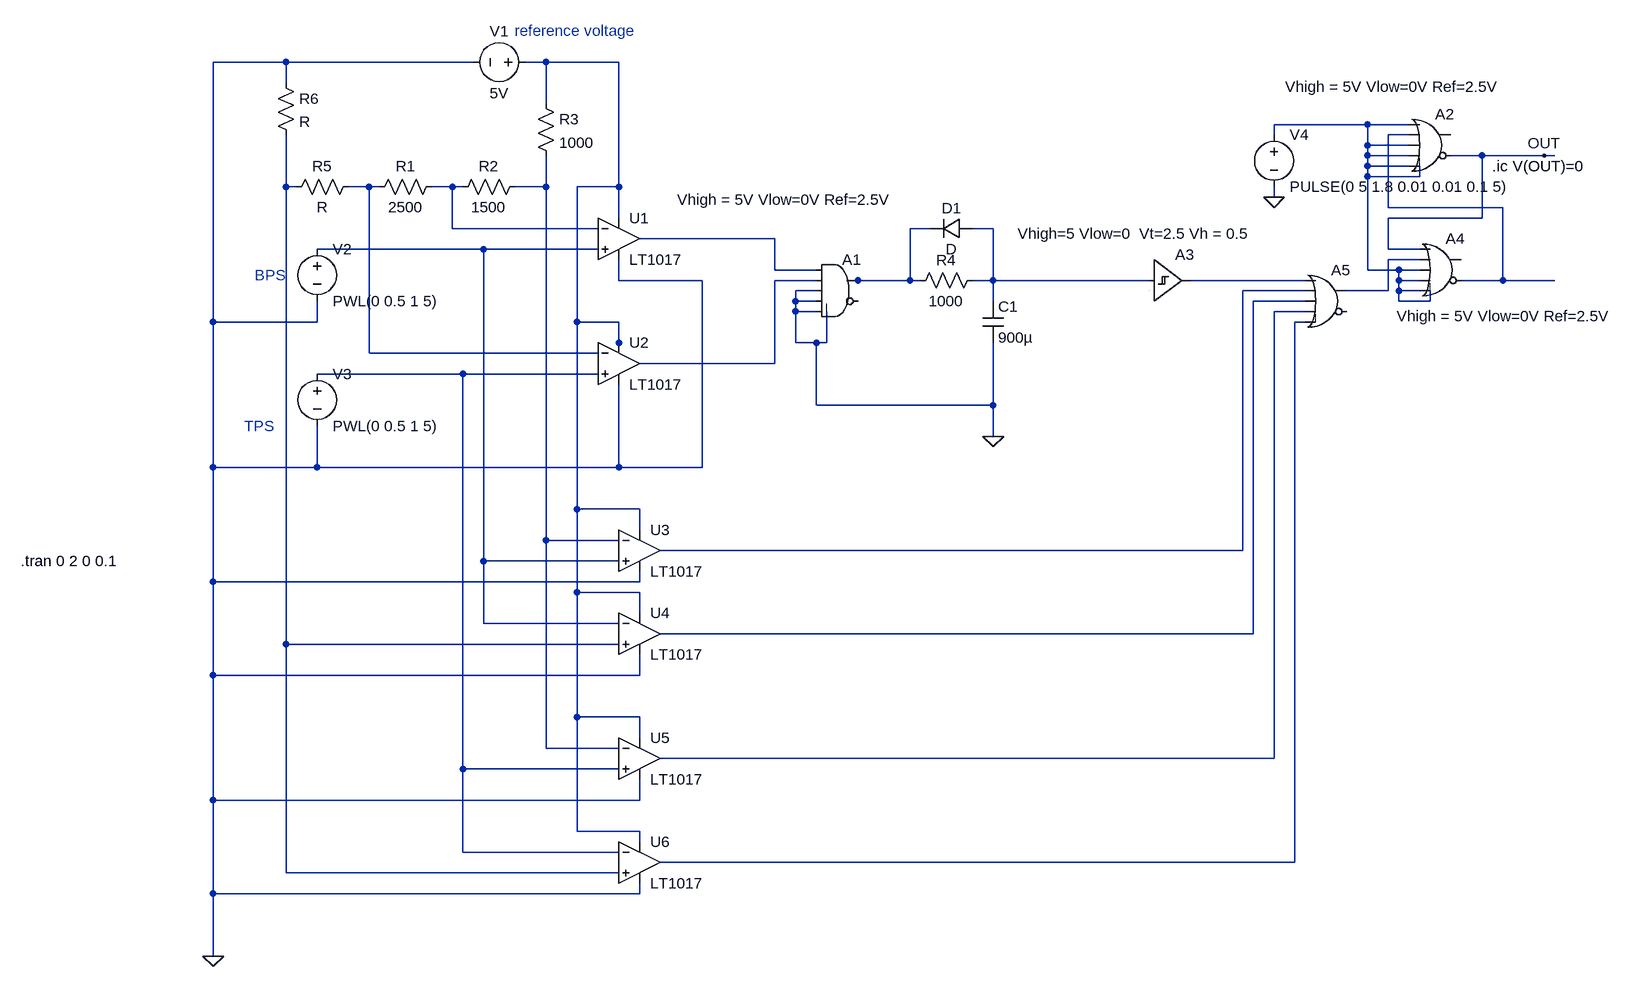
[diagram p0: schematic Draft4Andschem.asc]
Draft4Andschem.asc, the LTspice schematic file:
Version 4.1
SHEET 1 2128 1348
WIRE -64 -144 -176 -144
WIRE 224 -144 -64 -144
WIRE 336 -144 304 -144
WIRE 448 -144 336 -144
WIRE -64 -112 -64 -144
WIRE 336 -80 336 -144
WIRE 1600 -48 1456 -48
WIRE 1664 -48 1600 -48
WIRE 1456 -32 1456 -48
WIRE 1664 -32 1632 -32
WIRE 1600 -16 1600 -48
WIRE 1664 -16 1600 -16
WIRE 1600 0 1600 -16
WIRE 1664 0 1600 0
WIRE 1776 0 1728 0
WIRE 1872 0 1776 0
WIRE 1888 0 1872 0
WIRE 1600 16 1600 0
WIRE 1664 16 1600 16
WIRE 1600 32 1600 16
WIRE 1680 32 1680 16
WIRE 1680 32 1600 32
WIRE -64 48 -64 -32
WIRE -48 48 -64 48
WIRE 64 48 32 48
WIRE 80 48 64 48
WIRE 192 48 160 48
WIRE 208 48 192 48
WIRE 336 48 336 0
WIRE 336 48 288 48
WIRE 448 48 448 -144
WIRE 448 48 384 48
WIRE 1456 64 1456 48
WIRE 1632 80 1632 -32
WIRE 1808 80 1632 80
WIRE 448 96 448 48
WIRE 1776 96 1776 0
WIRE 1776 96 1632 96
WIRE 192 112 192 48
WIRE 416 112 192 112
WIRE 928 112 896 112
WIRE 1024 112 992 112
WIRE 688 128 480 128
WIRE 240 144 -16 144
WIRE 416 144 240 144
WIRE 1632 144 1632 96
WIRE 1680 144 1632 144
WIRE 1680 160 1632 160
WIRE 688 176 688 128
WIRE 752 176 688 176
WIRE 1600 176 1600 32
WIRE 1648 176 1600 176
WIRE 1680 176 1648 176
WIRE 448 192 448 160
WIRE 576 192 448 192
WIRE 752 192 688 192
WIRE 816 192 800 192
WIRE 896 192 896 112
WIRE 896 192 816 192
WIRE 912 192 896 192
WIRE 1024 192 1024 112
WIRE 1024 192 992 192
WIRE 1264 192 1024 192
WIRE 1504 192 1328 192
WIRE 1648 192 1648 176
WIRE 1680 192 1648 192
WIRE 1808 192 1808 80
WIRE 1808 192 1744 192
WIRE 1888 192 1808 192
WIRE 752 208 720 208
WIRE 1504 208 1408 208
WIRE 1632 208 1632 160
WIRE 1632 208 1568 208
WIRE 1648 208 1648 192
WIRE 1680 208 1648 208
WIRE 720 224 720 208
WIRE 752 224 720 224
WIRE 1024 224 1024 192
WIRE 1504 224 1424 224
WIRE 1648 224 1648 208
WIRE 1696 224 1696 208
WIRE 1696 224 1648 224
WIRE 720 240 720 224
WIRE 752 240 720 240
WIRE 1504 240 1456 240
WIRE -176 256 -176 -144
WIRE -16 256 -16 224
WIRE -16 256 -176 256
WIRE 384 256 384 48
WIRE 448 256 384 256
WIRE 1504 256 1488 256
WIRE 448 288 448 256
WIRE 720 288 720 240
WIRE 752 288 720 288
WIRE 768 288 768 240
WIRE 768 288 752 288
WIRE 64 304 64 48
WIRE 416 304 64 304
WIRE 448 304 448 288
WIRE 688 320 688 192
WIRE 688 320 480 320
WIRE 208 336 -16 336
WIRE 416 336 208 336
WIRE 752 384 752 288
WIRE 1024 384 1024 288
WIRE 1024 384 752 384
WIRE 1024 432 1024 384
WIRE -176 480 -176 256
WIRE -16 480 -16 416
WIRE -16 480 -176 480
WIRE 448 480 448 352
WIRE 448 480 -16 480
WIRE 576 480 576 192
WIRE 576 480 448 480
WIRE 384 544 384 256
WIRE 480 544 384 544
WIRE 480 576 480 544
WIRE 336 592 336 48
WIRE 448 592 336 592
WIRE 1408 608 1408 208
WIRE 1408 608 512 608
WIRE 240 624 240 144
WIRE 448 624 240 624
WIRE -176 656 -176 480
WIRE 480 656 480 640
WIRE 480 656 -176 656
WIRE 384 672 384 544
WIRE 480 672 384 672
WIRE 480 704 480 672
WIRE 240 720 240 624
WIRE 448 720 240 720
WIRE 1424 736 1424 224
WIRE 1424 736 512 736
WIRE -64 752 -64 48
WIRE 448 752 -64 752
WIRE -176 800 -176 656
WIRE 480 800 480 768
WIRE 480 800 -176 800
WIRE 384 864 384 672
WIRE 480 864 384 864
WIRE 480 896 480 864
WIRE 336 912 336 592
WIRE 448 912 336 912
WIRE 1456 928 1456 240
WIRE 1456 928 512 928
WIRE 208 944 208 336
WIRE 448 944 208 944
WIRE -176 992 -176 800
WIRE 480 992 480 960
WIRE 480 992 -176 992
WIRE 384 1040 384 864
WIRE 480 1040 384 1040
WIRE 480 1056 480 1040
WIRE 208 1072 208 944
WIRE 448 1072 208 1072
WIRE 1488 1088 1488 256
WIRE 1488 1088 512 1088
WIRE -64 1104 -64 752
WIRE 448 1104 -64 1104
WIRE -176 1136 -176 992
WIRE 480 1136 480 1120
WIRE 480 1136 -176 1136
WIRE -176 1232 -176 1136
FLAG -176 1232 0
FLAG 1024 432 0
FLAG 1456 64 0
FLAG 1872 0 OUT
SYMBOL voltage 320 -144 R90
WINDOW 0 -32 56 VBottom 2
WINDOW 3 32 56 VTop 2
WINDOW 123 0 0 Left 0
WINDOW 39 0 0 Left 0
SYMATTR InstName V1
SYMATTR Value 5V
SYMBOL voltage -16 128 R0
WINDOW 123 0 0 Left 0
WINDOW 39 0 0 Left 0
SYMATTR InstName V2
SYMATTR Value PWL(0 0.5 1 5)
SYMBOL voltage -16 320 R0
WINDOW 123 0 0 Left 0
WINDOW 39 0 0 Left 0
SYMATTR InstName V3
SYMATTR Value PWL(0 0.5 1 5)
SYMBOL Comparators\\LT1017 448 128 R0
SYMATTR InstName U1
SYMBOL Comparators\\LT1017 448 320 R0
SYMATTR InstName U2
SYMBOL res 64 64 R270
WINDOW 0 32 56 VTop 2
WINDOW 3 0 56 VBottom 2
SYMATTR InstName R1
SYMATTR Value 2500
SYMBOL res 304 32 R90
WINDOW 0 0 56 VBottom 2
WINDOW 3 32 56 VTop 2
SYMATTR InstName R2
SYMATTR Value 1500
SYMBOL Digital\\and 784 144 R0
WINDOW 123 -246 -76 Left 2
SYMATTR Value2 Vhigh = 5V Vlow=0V Ref=2.5V
SYMATTR InstName A1
SYMBOL res 320 -96 R0
SYMATTR InstName R3
SYMATTR Value 1000
SYMBOL cap 1008 224 R0
SYMATTR Value 900µ
SYMATTR InstName C1
SYMATTR SpiceLine V=35 Irms=8.165 Rser=0.009 Lser=0 mfg="Vishay" pn="T54E6907M035" type="Tantalum Polymer"
SYMBOL res 1008 176 R90
WINDOW 0 0 56 VBottom 2
WINDOW 3 32 56 VTop 2
SYMATTR InstName R4
SYMATTR Value 1000
SYMBOL diode 992 96 R90
WINDOW 0 0 32 VBottom 2
WINDOW 3 32 32 VTop 2
SYMATTR InstName D1
SYMBOL Digital\\schmtbuf 1264 128 R0
WINDOW 3 -202 -8 Left 2
SYMATTR Value Vhigh=5 Vlow=0  Vt=2.5 Vh = 0.5
SYMATTR InstName A3
SYMBOL Digital\\or 1696 -80 R0
WINDOW 123 -223 -26 Left 2
SYMATTR Value2 Vhigh = 5V Vlow=0V Ref=2.5V
SYMATTR InstName A2
SYMBOL Digital\\or 1712 112 R0
WINDOW 123 -67 135 Left 2
SYMATTR Value2 Vhigh = 5V Vlow=0V Ref=2.5V
SYMATTR InstName A4
SYMBOL voltage 1456 -48 R0
WINDOW 123 0 0 Left 0
WINDOW 39 0 0 Left 0
SYMATTR InstName V4
SYMATTR Value PULSE(0 5 1.8 0.01 0.01 0.1 5)
SYMBOL Comparators\\LT1017 480 608 R0
SYMATTR InstName U3
SYMBOL Comparators\\LT1017 480 736 R0
SYMATTR InstName U4
SYMBOL Comparators\\LT1017 480 928 R0
SYMATTR InstName U5
SYMBOL Comparators\\LT1017 480 1088 R0
SYMATTR InstName U6
SYMBOL res -64 64 R270
WINDOW 0 32 56 VTop 2
WINDOW 3 0 56 VBottom 2
SYMATTR InstName R5
SYMBOL res -80 -128 R0
SYMATTR InstName R6
SYMBOL Digital\\or 1536 160 R0
SYMATTR InstName A5
TEXT -112 184 Left 2 ;BPS
TEXT -128 416 Left 2 ;TPS
TEXT 288 -192 Left 2 ;reference voltage
TEXT -472 624 Left 2 !.tran 0 2 0 0.1
TEXT 1792 16 Left 2 !.ic V(OUT)=0

The netlist it stands for:
* Draft4Andschem.asc
V1 N001 0 5V
V2 N011 0 PWL(0 0.5 1 5)
V3 N019 0 PWL(0 0.5 1 5)
X§U1 N011 N006 N001 0 N010 LT1017  ; pins In+ In- V+ V- OUT
X§U2 N019 N005 N001 0 N013 LT1017  ; pins In+ In- V+ V- OUT
R1 N005 N006 2500
R2 N007 N006 1500
A1 N010 N013 0 0 0 0 N008 0 AND Vhigh = 5V Vlow=0V Ref=2.5V
R3 N001 N007 1000
C1 N009 0 900µ V=35 Irms=8.165 Rser=0.009 Lser=0 mfg="Vishay" pn="T54E6907M035" type="Tantalum Polymer"
R4 N009 N008 1000
D1 N009 N008 D
A3 N009 0 0 0 0 0 N014 0 SCHMITT Vhigh=5 Vlow=0  Vt=2.5 Vh = 0.5
A2 N002 N003 N002 N002 N002 OUT N002 N002 OR Vhigh = 5V Vlow=0V Ref=2.5V
A4 OUT N012 N002 N002 N002 N003 N002 N002 OR Vhigh = 5V Vlow=0V Ref=2.5V
V4 N002 0 PULSE(0 5 1.8 0.01 0.01 0.1 5)
X§U3 N011 N007 N001 0 N015 LT1017  ; pins In+ In- V+ V- OUT
X§U4 N004 N011 N001 0 N016 LT1017  ; pins In+ In- V+ V- OUT
X§U5 N019 N007 N001 0 N017 LT1017  ; pins In+ In- V+ V- OUT
X§U6 N004 N019 N001 0 N018 LT1017  ; pins In+ In- V+ V- OUT
R5 N004 N005 R
R6 0 N004 R
A5 N014 N015 N016 N017 N018 0 N012 0 OR
.model D D
.lib standard.dio
* BPS
* TPS
* reference voltage
.tran 0 2 0 0.1
.ic V(OUT)=0
.backanno
.end